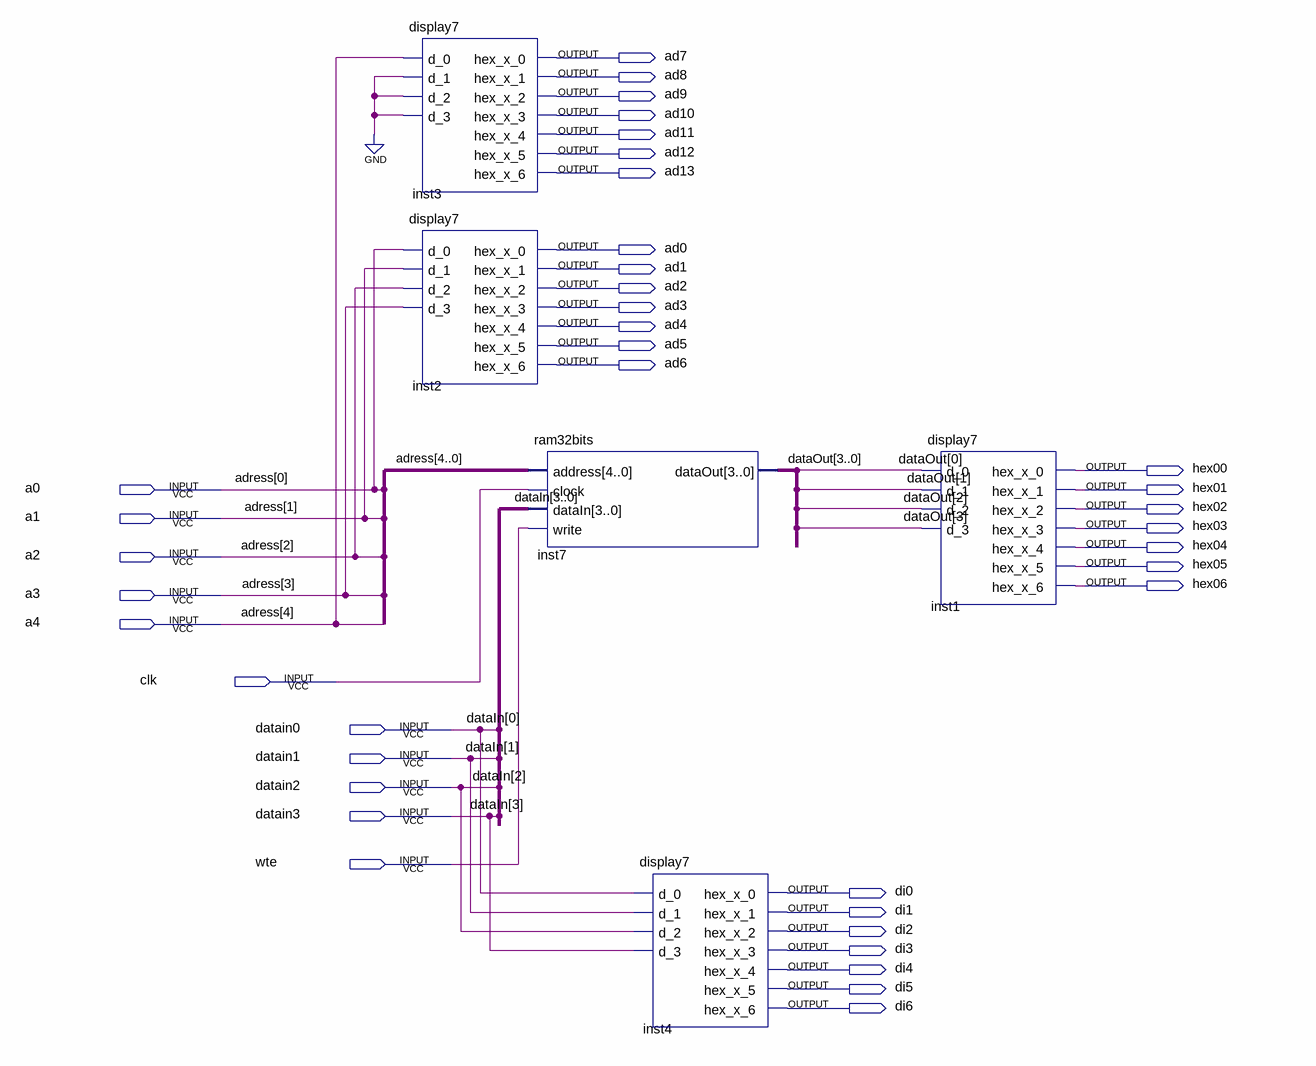
[diagram p0: schematic sheet]
// Quartus schematic lab8.bdf as structural Verilog: 5 symbols, 39 pins
module lab8 (
  input  a0,
  input  a1,
  input  a2,
  input  a3,
  input  a4,
  input  clk,
  input  datain0,
  input  datain1,
  input  datain2,
  input  datain3,
  input  wte,
  output ad7,
  output ad8,
  output ad9,
  output ad10,
  output ad11,
  output ad12,
  output ad13,
  output ad0,
  output ad1,
  output ad2,
  output ad3,
  output ad4,
  output ad5,
  output ad6,
  output hex00,
  output hex01,
  output hex02,
  output hex03,
  output hex04,
  output hex05,
  output hex06,
  output di0,
  output di1,
  output di2,
  output di3,
  output di4,
  output di5,
  output di6
);

  wire [3:0] dataOut;

  display7 inst3 (
    .d_0(a4), .d_1(1'b0), .d_2(1'b0), .d_3(1'b0), .hex_x_0(ad7), .hex_x_1(ad8), .hex_x_2(ad9),
    .hex_x_3(ad10), .hex_x_4(ad11), .hex_x_5(ad12), .hex_x_6(ad13));
  display7 inst2 (
    .d_0(a0), .d_1(a1), .d_2(a2), .d_3(a3), .hex_x_0(ad0), .hex_x_1(ad1), .hex_x_2(ad2), .hex_x_3(ad3),
    .hex_x_4(ad4), .hex_x_5(ad5), .hex_x_6(ad6));
  ram32bits inst7 (
    .address({a4, a3, a2, a1, a0}), .clock(clk), .dataIn({datain3, datain2, datain1, datain0}), .write(wte),
    .dataOut(dataOut));
  display7 inst4 (
    .d_0(datain0), .d_1(datain1), .d_2(datain2), .d_3(datain3), .hex_x_0(di0), .hex_x_1(di1), .hex_x_2(di2),
    .hex_x_3(di3), .hex_x_4(di4), .hex_x_5(di5), .hex_x_6(di6));
  display7 inst1 (
    .d_0(dataOut[0]), .d_1(dataOut[1]), .d_2(dataOut[2]), .d_3(dataOut[3]), .hex_x_0(hex00), .hex_x_1(hex01),
    .hex_x_2(hex02), .hex_x_3(hex03), .hex_x_4(hex04), .hex_x_5(hex05), .hex_x_6(hex06));

  // Other names for the same wires on the sheet: adress[4:0] = {a4, a3, a2, a1, a0}
endmodule
